# Altium schematic sheet LO.SchDoc
size A
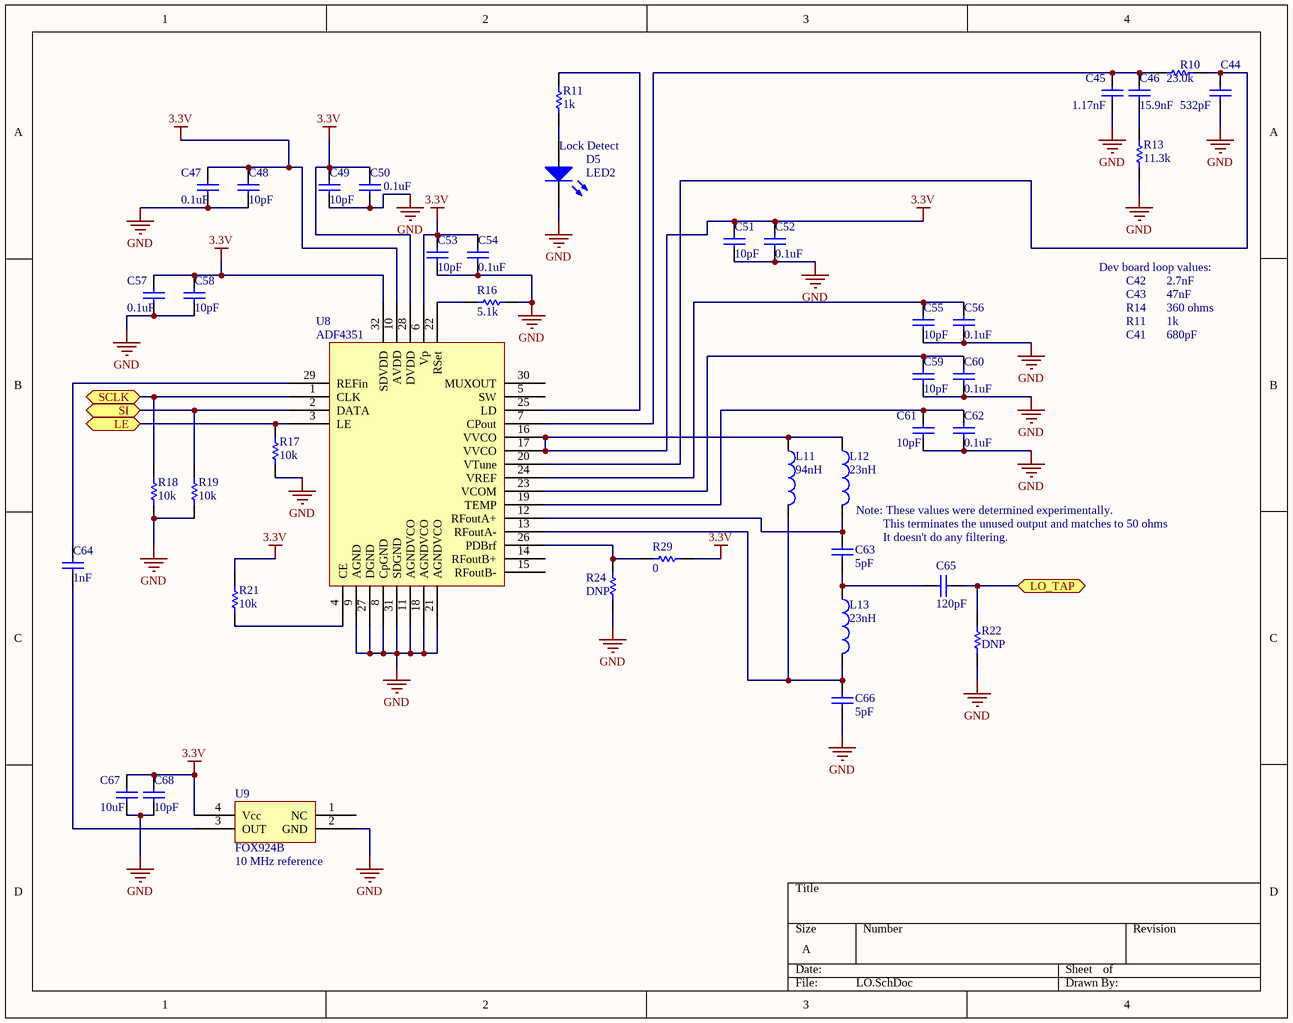
[diagram p0: LO.SchDoc]

## Parts
C44  value 532pF  [0402]  (hidden comment: Cap Semi)
C45  value 1.17nF  [0402]  (hidden comment: Cap Semi)
C46  value 15.9nF  [0402]  (hidden comment: Cap Semi)
C47  value 0.1uF  [0402]  (hidden comment: Cap Semi)
C48  value 10pF  [0402]  (hidden comment: Cap Semi)
C49  value 10pF  [0402]  (hidden comment: Cap Semi)
C50  value 0.1uF  [0402]  (hidden comment: Cap Semi)
C51  value 10pF  [0402]  (hidden comment: Cap Semi)
C52  value 0.1uF  [0402]  (hidden comment: Cap Semi)
C53  value 10pF  [0402]  (hidden comment: Cap Semi)
C54  value 0.1uF  [0402]  (hidden comment: Cap Semi)
C55  value 10pF  [0402]  (hidden comment: Cap Semi)
C56  value 0.1uF  [0402]  (hidden comment: Cap Semi)
C57  value 0.1uF  [0402]  (hidden comment: Cap Semi)
C58  value 10pF  [0402]  (hidden comment: Cap Semi)
C59  value 10pF  [0402]  (hidden comment: Cap Semi)
C60  value 0.1uF  [0402]  (hidden comment: Cap Semi)
C61  value 10pF  [0402]  (hidden comment: Cap Semi)
C62  value 0.1uF  [0402]  (hidden comment: Cap Semi)
C63  value 5pF  [0402]  (hidden comment: Cap Semi)
C64  value 1nF  [0402]  (hidden comment: Cap Semi)
C65  value 120pF  [0402]  (hidden comment: Cap Semi)
C66  value 5pF  [0402]  (hidden comment: Cap Semi)
C67  value 10uF  [0402]  (hidden comment: Cap Semi)
C68  value 10pF  [0402]  (hidden comment: Cap Semi)
D5  LED2  [0603]
L11  value 94nH  [0402]  (hidden comment: Inductor)
L12  value 23nH  [0402]  (hidden comment: Inductor)
L13  value 23nH  [0402]  (hidden comment: Inductor)
R10  value 23.0k  [0402]  (hidden comment: Res Semi)
R11  value 1k  [0402]  (hidden comment: Res Semi)
R13  value 11.3k  [0402]  (hidden comment: Res Semi)
R16  value 5.1k  [0402]  (hidden comment: Res Semi)
R17  value 10k  [0402]  (hidden comment: Res Semi)
R18  value 10k  [0402]  (hidden comment: Res Semi)
R19  value 10k  [0402]  (hidden comment: Res Semi)
R21  value 10k  [0402]  (hidden comment: Res Semi)
R22  value DNP  [0402]  (hidden comment: Res Semi)
R24  value DNP  [0402]  (hidden comment: Res Semi)
R29  value 0  [0402]  (hidden comment: Res Semi)
U8  ADF4351  [QFN50P500X500-32VBN]
U9  FOX924B  [FOX924]

## Ports
LE, LO_TAP, SCLK, SI

## Nets
3.3V: C47.1 C48.1 C49.1 C50.1 C51.1 C52.1 C53.1 C54.1 C57.1 C58.1 C67.1 C68.1 L11.1 L12.1 R21.1 R29.2 U8.6(Vp) U8.10(AVDD) U8.16(VVCO) U8.17(VVCO) U8.28(DVDD) U8.32(SDVDD) U9.4(Vcc)
GND: C44.2 C45.2 C47.2 C48.2 C49.2 C50.2 C51.2 C52.2 C53.2 C54.2 C55.2 C56.2 C57.2 C58.2 C59.2 C60.2 C61.2 C62.2 C66.2 C67.2 C68.2 D5.2(K) R13.2 R16.1 R17.2 R18.2 R19.2 R22.2 R24.2 U8.8(CpGND) U8.9(AGND) U8.11(AGNDVCO) U8.18(AGNDVCO) U8.21(AGNDVCO) U8.27(DGND) U8.31(SDGND) U9.2(GND)
LE: R17.1 U8.3(LE) ; port LE
LO_TAP: C65.2 R22.1 ; port LO_TAP
SCLK: R18.1 U8.1(CLK) ; port SCLK
SI: R19.1 U8.2(DATA) ; port SI
NetC44_1: C44.1 R10.1 U8.20(VTune)
NetC45_1: C45.1 C46.1 R10.2 U8.7(CPout)
NetC46_2: C46.2 R13.1
NetC55_1: C55.1 C56.1 U8.24(VREF)
NetC59_1: C59.1 C60.1 U8.23(VCOM)
NetC61_1: C61.1 C62.1 U8.19(TEMP)
NetC63_1: C63.1 L12.2 U8.12(RFoutA+)
NetC63_2: C63.2 C65.1 L13.1
NetC64_1: C64.1 U8.29(REFin)
NetC64_2: C64.2 U9.3(OUT)
NetC66_1: C66.1 L11.2 L13.2 U8.13(RFoutA-)
NetD5_1: D5.1(A) R11.2
NetR11_1: R11.1 U8.25(LD)
NetR16_2: R16.2 U8.22(RSet)
NetR21_2: R21.2 U8.4(CE)
NetR24_1: R24.1 R29.1 U8.26(PDBrf)

Not connected (* = marked no-connect by the designer): U8 5(SW) 14(RFoutB+) 15(RFoutB-) 30(MUXOUT); U9 1(NC)

## Notes on the sheet
- (near D5) Lock Detect
- Dev board loop values:
- C42
- C43
- 2.7nF
- 47nF
- R14
- R11
- C41
- 360 ohms
- 1k
- 680pF
- (near L12) Note: These values were determined experimentally.
- This terminates the unused output and matches to 50 ohms
- It doesn't do any filtering.
- (near U9) 10 MHz reference

## Library data of the parts
C44-C68 = Cap Semi: Capacitor (Semiconductor SIM Model); Published: 8-Jun-2000; LatestRevisionDate: 29-May-2009; LatestRevisionNote: IPC-7351 Footprint Added.; PackageReference: C1206; Publisher: Altium Limited; PackageDescription: Chip Capacitor
D5 = LED2: Typical RED, GREEN, YELLOW, AMBER GaAs LED; Published: 8-Jun-2000; LatestRevisionDate: 17-Jul-2002; LatestRevisionNote: Re-released for DXP Platform.; PackageVersion: Feb-2002; PackageReference: 3.2X1.6X1.1; Publisher: Altium Limited; PackageDescription: SM LED; 2 Flat Leads
L11-L13 = Inductor: Code_IEC: 1005; Published: 8-Jun-2000; LatestRevisionDate: 29-May-2009; LatestRevisionNote: IPC-7351 Footprint Added.; PackageReference: 0402-A; Publisher: Altium Limited; PackageDescription: Chip Inductor; Code_JEITA: 0402
R10 R11 R13 R16-R19 R21 R22 R24 R29 = Res Semi: Semiconductor Resistor; Published: 8-Jun-2000; LatestRevisionDate: 17-Jul-2002; LatestRevisionNote: Re-released for DXP Platform.; PackageReference: AXIAL-0.5; Publisher: Altium Limited; PackageDescription: Axial Device, Thru-Hole; 2 Leads; 0.5 in Pin Spacing
U8 = ADF4350: VCO
U9 = FOX924